# EasyEDA schematic SCH_task3_2026-04-27.json
TITLE: Sheet_1; REV: 1.0; Date: 2026-04-27; Sheet: 1/1; Drawn By: nare.manukian222; Company: Your Company
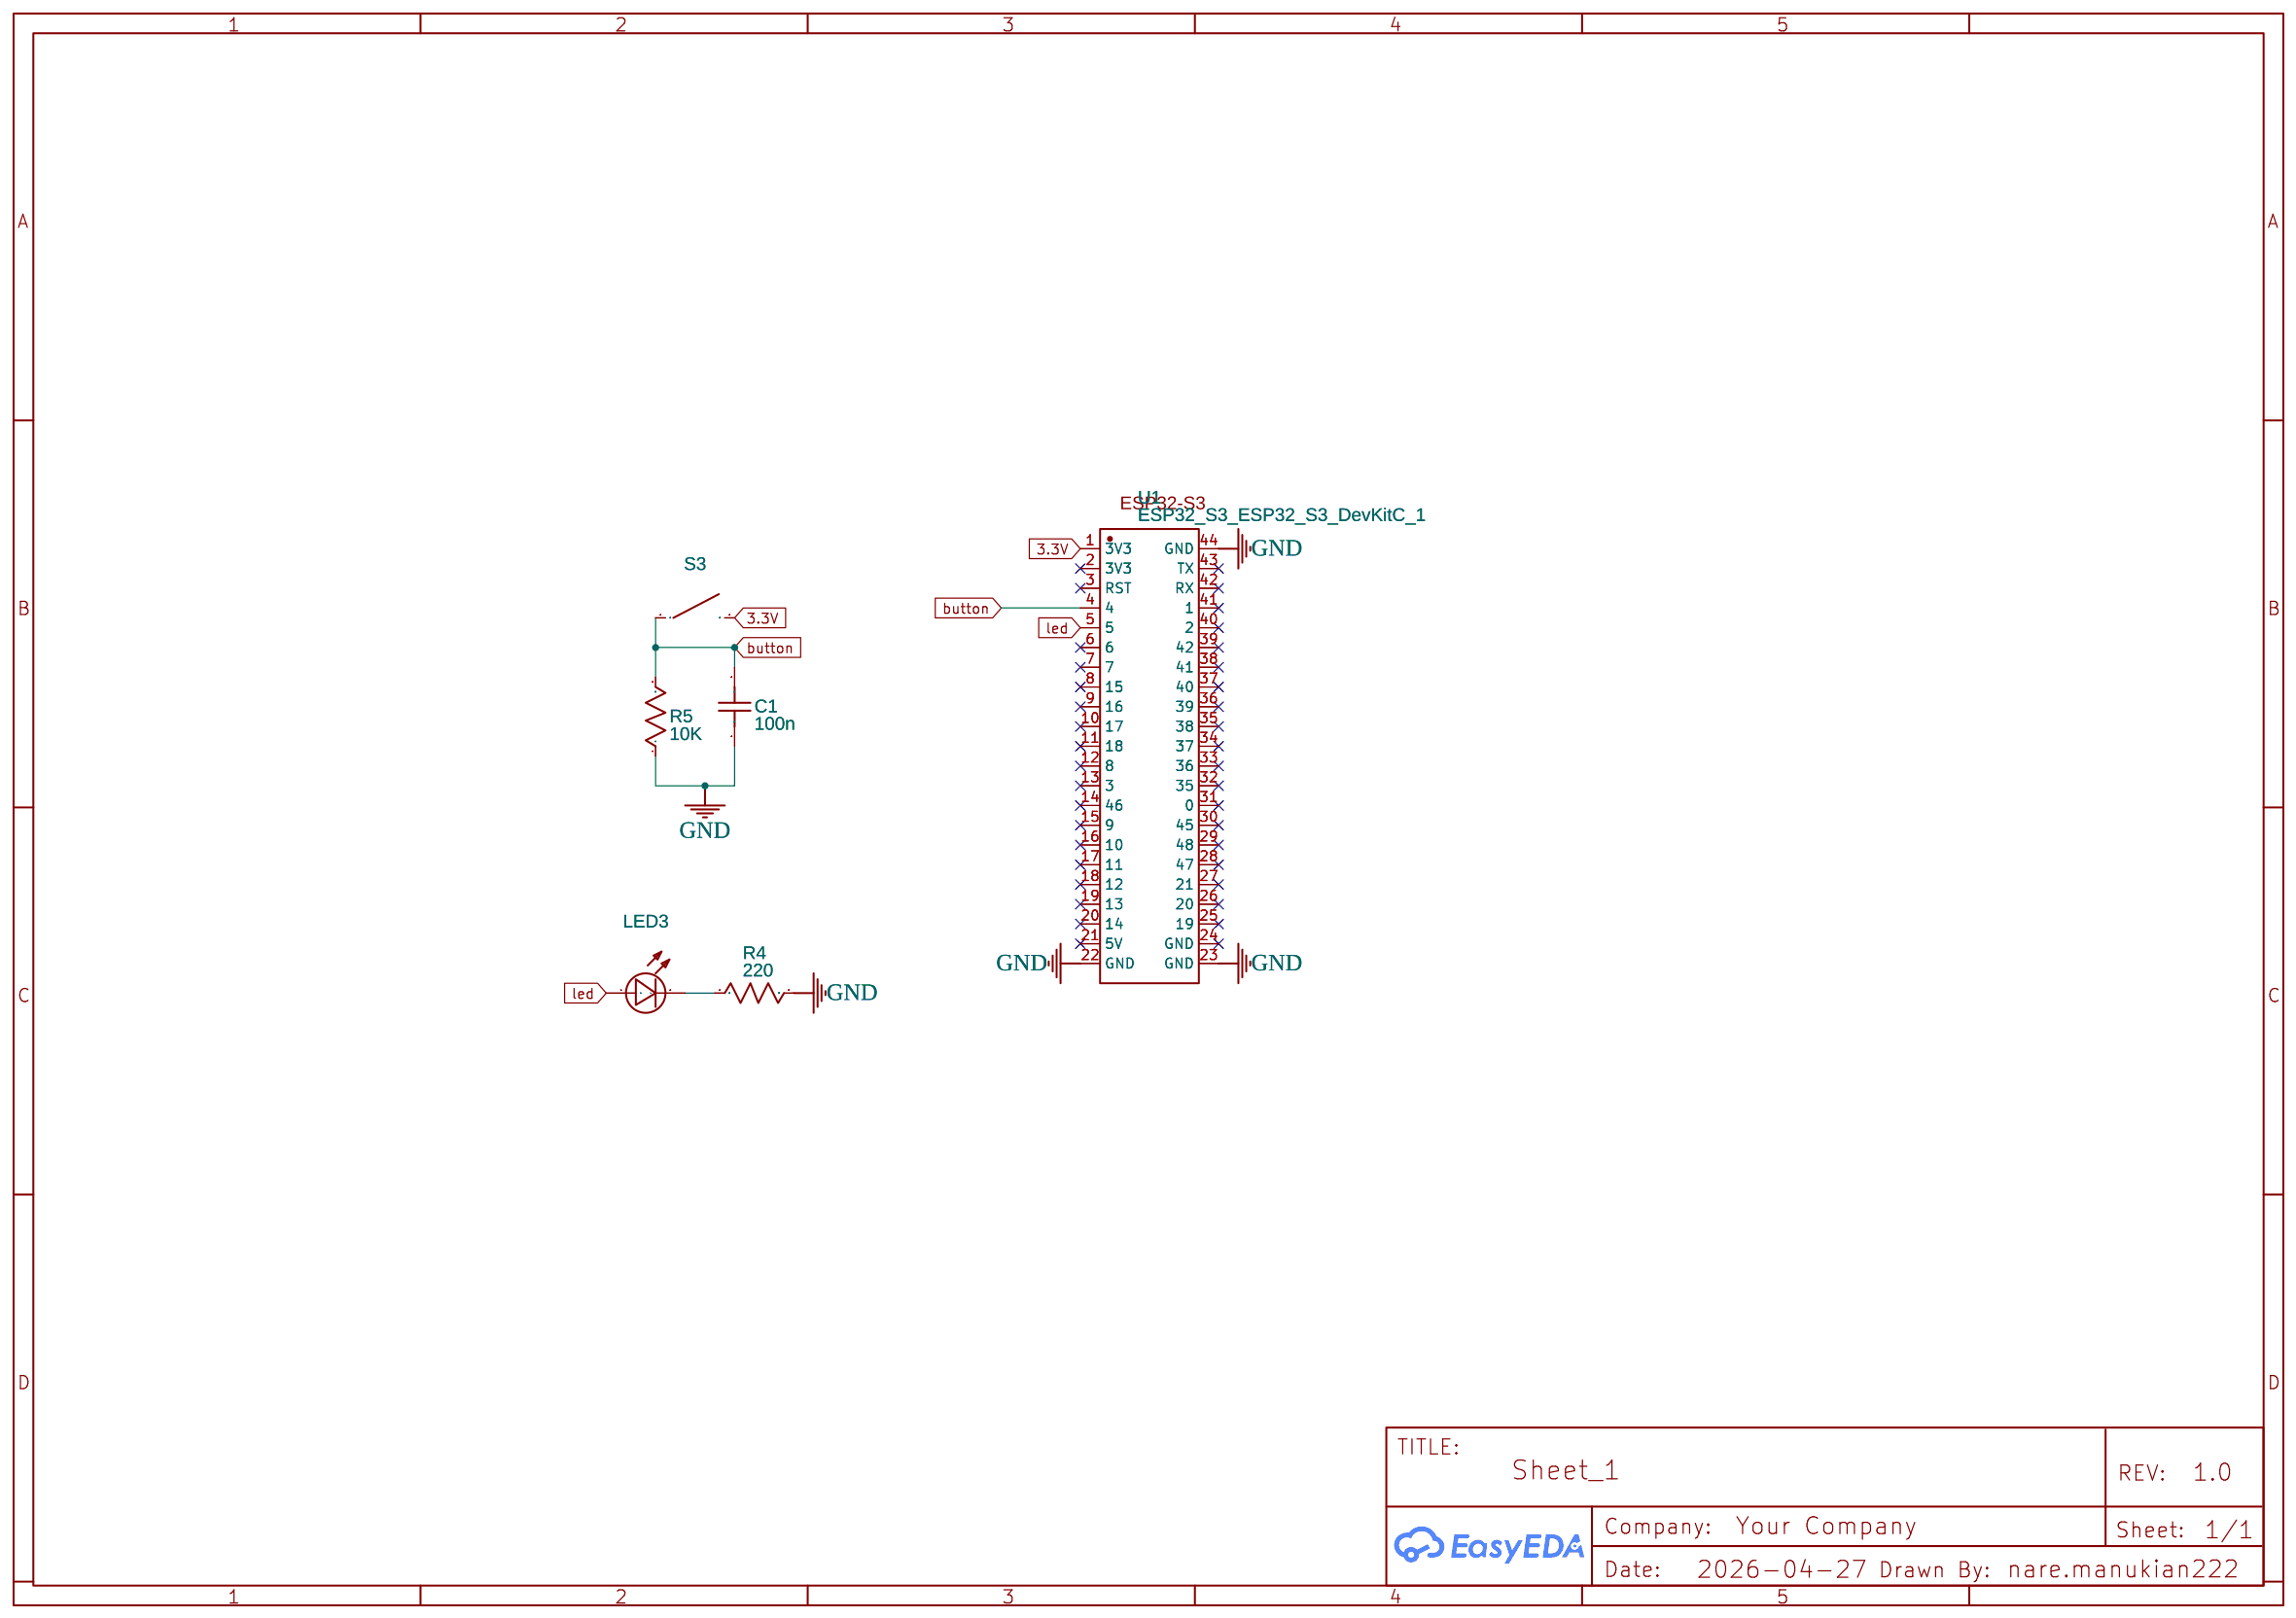
[diagram p0: schematic sheet]

## Parts
C1  100n  [RAD-0.1]
LED3  LED  [LED-SMD_14P-L6.7-W6.3-LED-TX-6070-RGBYLWP]
R4  220  [AXIAL-0.3]
R5  10K  [AXIAL-0.3]
S3  SPST_Open  [PUSHBUTTON_2PINS-MY CUSTOM BUTTON]
U1  ESP32_S3_ESP32_S3_DevKitC_1  [ESP 32 S3]

## Library data of the parts
C1 = Capacitor_US: Contributor: EasyEDA; Supplier: YUJING; Capacitance: 1u
LED3 = LED: catid: 20; Contributor: 仿真库绘制; Color: Red; NameDisplay: 0
R4 R5 = Resistor_US: Resistance: 1k; Contributor: EasyEDA; Supplier: YUJING
S3 = SPST: catid: 20; State: Open; Contributor: EasyEDA; NameDisplay: 0
U1 = ESP32_S3_ESP32_S3_DevKitC_1: catid: 20; link: https://www.amazon.se/dp/B0CRK47HXM?ref=ppx_yo2ov_dt_b_product_details&th=1; Contributor: gkwdissa530; Supplier Part: ESP32-S3 ESP32-S3-DevKitC-1; Manufacturer: DUBEUYEW; sim: true

## Nets
3.3V: S3.2 U1.1(3V3)
GND: C1.1 R4.2 R5.1 U1.22(GND) U1.23(GND) U1.44(GND)
button: C1.2 R5.2 S3.1 U1.4
led: LED3.1(+) U1.5
Net-(LED3-2): LED3.2(-) R4.1

Not connected (* = marked no-connect by the designer): U1 2(3V3)* 3(RST)* 6* 7* 8(15)* 9(16)* 10(17)* 11(18)* 12(8)* 13(3)* 14(46)* 15(9)* 16(10)* 17(11)* 18(12)* 19(13)* 20(14)* 21(5V)* 24(GND)* 25(19)* 26(20)* 27(21)* 28(47)* 29(48)* 30(45)* 31(0)* 32(35)* 33(36)* 34(37)* 35(38)* 36(39)* 37(40)* 38(41)* 39(42)* 40(2)* 41(1)* 42(RX)* 43(TX)*
